# EAGLE design OneSLiPoCharger (EAGLE 7.7.0)
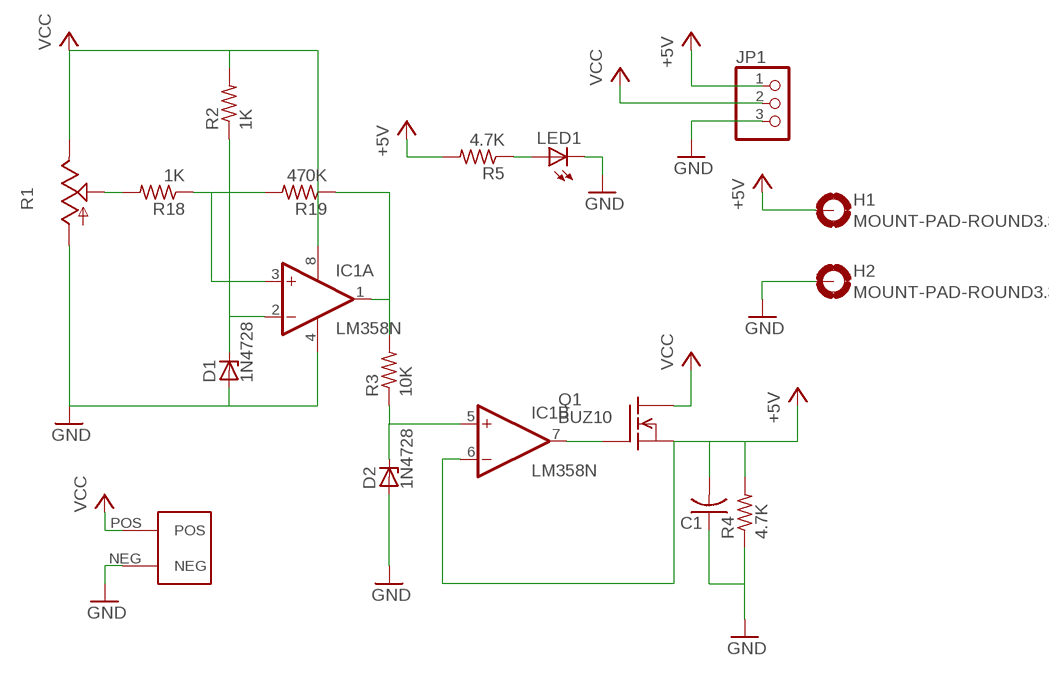
[diagram p0: schematic, sheet 1]

## Parts
C1  C-US025-025X050  [C025-025X050]
D1  1N4728  [DO41Z10]
D2  1N4728  [DO41Z10]
H1  MOUNT-PAD-ROUND3.3  [3,3-PAD]
H2  MOUNT-PAD-ROUND3.3  [3,3-PAD]
IC1  LM358N  [DIL08]
JP1  PINHD-1X3  [1X03]
LED1  LED3MM  [LED3MM]
Q1  BUZ10  [TO220]
R1  TRIM_US-B25P  [B25P]
R2  1K  R-US_0207/10  [0207/10]
R3  10K  R-US_0207/10  [0207/10]
R4  4.7K  R-US_0207/10  [0207/10]
R5  4.7K  R-US_0207/10  [0207/10]
R18  1K  R-US_0207/10  [0207/10]
R19  470K  R-US_0207/10  [0207/10]
U$3  XT60  [XT60]

## Nets
+5V: C1.2 H1.B3,3(MOUNT) IC1.6(B:-IN) JP1.1 Q1.3(S) R4.2 R5.2
GND: C1.1 D1.A D2.A H2.B3,3(MOUNT) IC1.4(P:V-) JP1.3 LED1.K(C) R1.A R4.1 U$3.NEG
N$1: R1.S R18.2
N$2: D2.C IC1.5(B:+IN) R3.1
N$3: D1.C IC1.2(A:-IN) R2.1
N$4: IC1.1(A:OUT) R3.2 R19.1
N$5: IC1.7(B:OUT) Q1.1(G)
N$10: LED1.A R5.1
N$31: IC1.3(A:+IN) R18.1 R19.2
VCC: IC1.8(P:V+) JP1.2 Q1.2(D) R1.E R2.2 U$3.POS

## Library data of the parts
C1 = rcl:C-US: CAPACITOR, American symbol
D1 D2 = diode:1N4728: Z DIODE 3.3 V, 1W, 5 percent
H1 H2 = holes:MOUNT-PAD-ROUND: MOUNTING PAD, round
IC1 = linear:LM358: OP AMP also LM158; LM258; LM2904 Source: http://cache.national.com/ds/LM/LM158.pdf
JP1 = pinhead:PINHD-1X3: PIN HEADER
LED1 = led:LED: LED OSRAM: - CHIPLED LG R971, LG N971, LY N971, LG Q971, LY Q971, LO R971, LY R971 LH N974, LH R974 LS Q976, LO Q976, LY Q976 LO Q996 - Hyper CHIPLED LW Q18S LB Q993, LB Q99A, LB R99A - SideLED LS A670, LO A670, LY A670, LG A670, LP A670 LB A673, LV A673, LT A673, LW A673 LH A674 LY A675 LS A676, LA A676, LO A676, LY A676, LW A676 LS A679, LY A679, LG A679 - Hyper Micro SIDELED® LS Y876, LA Y876, LO Y876, LY Y876 LT Y87S - SmartLED LW L88C, LW L88S LB L89C, LB L89S, LG L890 LS L89K, LO L89K, LY L89K LS L896, LA L896, LO L896, LY L896 - TOPLED LS T670, LO T670, LY T670, LG T670, LP T670 LSG T670, LSP T670, LSY T670, LOP T670, LYG T670 LG T671, LOG T671, LSG T671 LB T673, LV T673, LT T673, LW T673 LH T674 LS T676, LA T676, LO T676, LY T676, LB T676, LH T676, LSB T676, LW T676 LB T67C, LV T67C, LT T67C, LS T67K, LO T67K, LY T67K, LW E67C LS E67B, LA E67B, LO E67B, LY E67B, LB E67C, LV E67C, LT E67C LW T67C LS T679, LY T679, LG T679 LS T770, LO T770, LY T770, LG T770, LP T770 LB T773, LV T773, LT T773, LW T773 LH T774 LS E675, LA E675, LY E675, LS T675 LS T776, LA T776, LO T776, LY T776, LB T776 LHGB T686 LT T68C, LB T68C - Hyper Mini TOPLED® LB M676 - Mini TOPLED Santana® LG M470 LS M47K, LO M47K, LY M47K Source: http://www.osram.convergy.de LUXEON: - LUMILED® LXK2-PW12-R00, LXK2-PW12-S00, LXK2-PW14-U00, LXK2-PW14-V00 LXK2-PM12-R00, LXK2-PM12-S00, LXK2-PM14-U00 LXK2-PE12-Q00, LXK2-PE12-R00, LXK2-PE12-S00, LXK2-PE14-T00, LXK2-PE14-U00 LXK2-PB12-K00, LXK2-PB12-L00, LXK2-PB12-M00, LXK2-PB14-N00, LXK2-PB14-P00, LXK2-PB14-Q00 LXK2-PR12-L00, LXK2-PR12-M00, LXK2-PR14-Q00, LXK2-PR14-R00 LXK2-PD12-Q00, LXK2-PD12-R00, LXK2-PD12-S00 LXK2-PH12-R00, LXK2-PH12-S00 LXK2-PL12-P00, LXK2-PL12-Q00, LXK2-PL12-R00 Source: www.luxeon.com KINGBRIGHT: KA-3528ASYC Source: www.kingbright.com
Q1 = transistor-fet:BUZ10: N-Channel Enhancement MOSFET 50V; 20A; 0,080Ohm
R1 = pot:TRIM_US-: POTENTIOMETER
R2-R5 R18 R19 = rcl:R-US_: RESISTOR, American symbol
U$3 = XTConnector:XT60

## Board
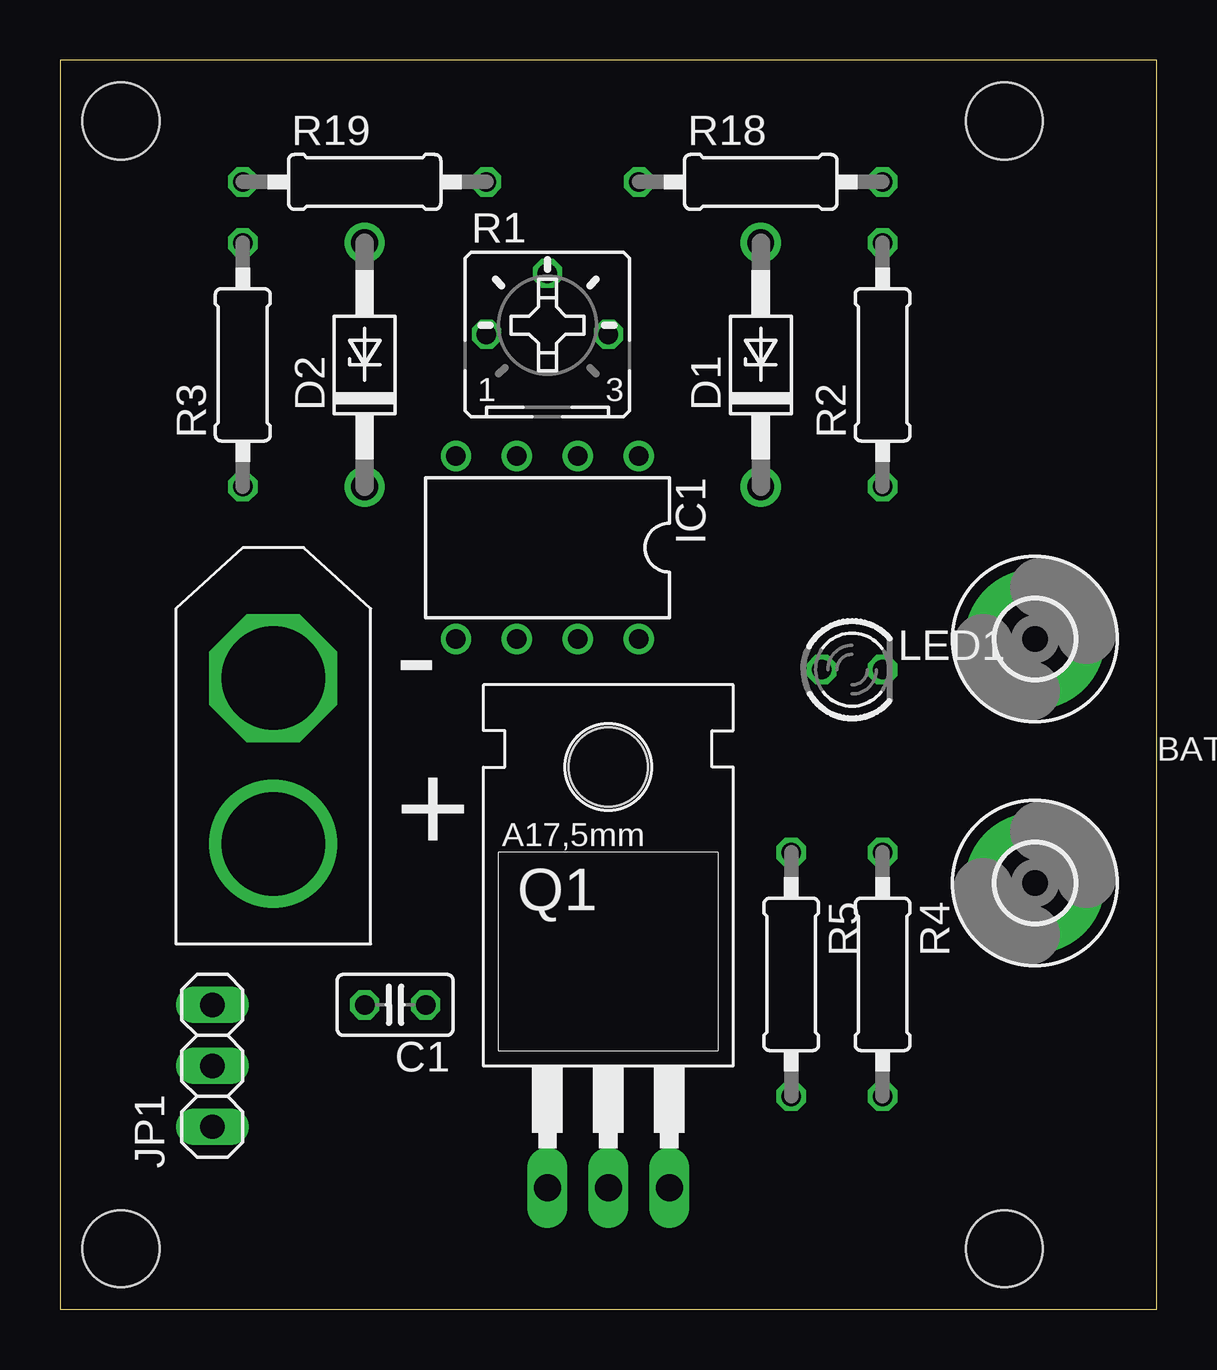
[diagram p1: board, top side]
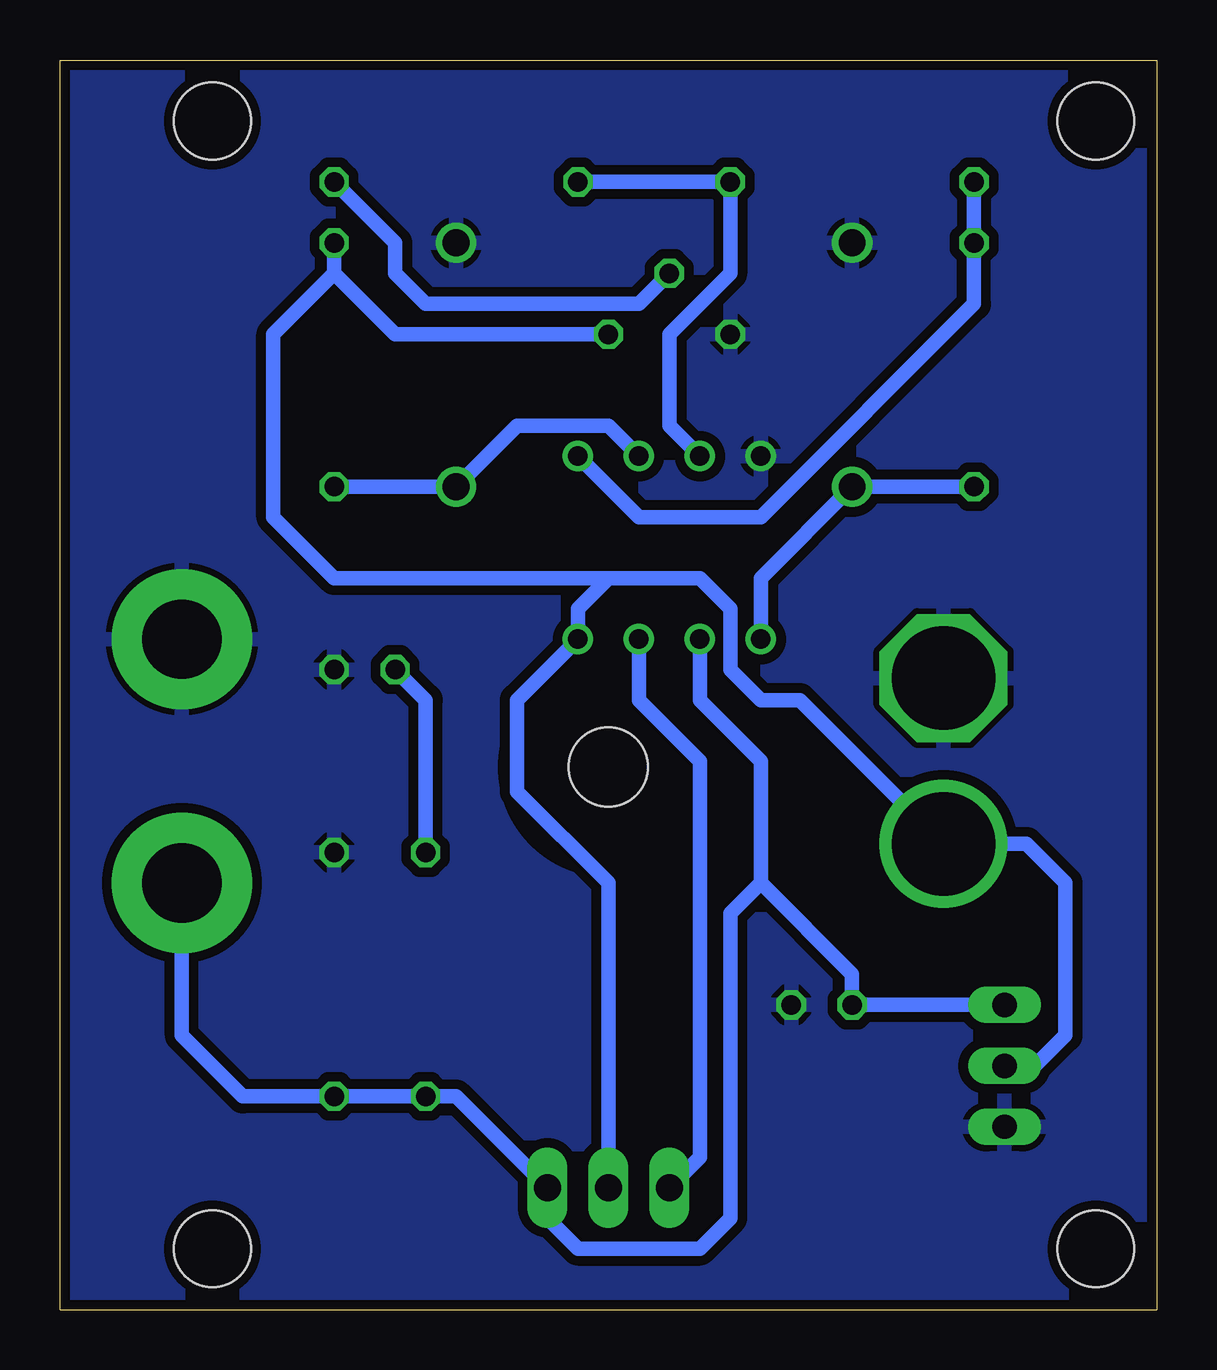
[diagram p2: board, bottom side, seen from below]

Size 45.72 x 52.07 mm. Coordinates in mm from the lower left corner, seen from the top.
Outline: 45.72,0 45.72,52.07 0,52.07 0,0 45.72,0
Copper layers (1*16): Top 0.0356mm / dielectric 1.5011mm / Bottom 0.0356mm
Design rules "LaenPCBOrder": minimum track width 6mil, minimum drill 13mil, track to track 6mil, track to pad 6mil, pad to pad 6mil, via to via 6mil, smd to smd 6mil, copper to edge 15mil, drill to drill 6mil, minimum pad ring 7mil, minimum via ring 7mil, stop-mask expansion 3mil, vias tented up to drill 0mil, thermal gap 10mil
Holes 3.2 mm at 2.54,2.54 2.54,49.53 39.37,49.53 39.37,2.54

### Footprints (pad centres in the part's own frame; a part is rotated, then mirrored left to right if it is on the bottom)
C025-025X050 = drill 0.813 octagon: 1 -1.27,0; 2 1.27,0
DO41Z10 = drill 1.118: A 5.08,0; C -5.08,0
3,3-PAD = drill 3.3 pad 5.842: B3,3 0,0
DIL08 = drill 0.813 pad 1.27: 1 -3.81,-3.81; 2 -1.27,-3.81; 3 1.27,-3.81; 4 3.81,-3.81; 5 3.81,3.81; 6 1.27,3.81; 7 -1.27,3.81; 8 -3.81,3.81
1X03 = drill 1.016 long: 1 -2.54,0; 2 0,0; 3 2.54,0
LED3MM = drill 0.813 octagon: A -1.27,0; K 1.27,0
TO220 = drill 1.118 long: 1 -2.54,-6.35; 2 0,-6.35; 3 2.54,-6.35 | hole 3.302: 0,11.176
B25P = drill 0.813 octagon: A -2.54,0; E 2.54,0; S 0,2.54
0207/10 = drill 0.813 octagon: 1 -5.08,0; 2 5.08,0
XT60 = drill 4.318 octagon: NEG 0,3.454 | drill 4.318: POS 0,-3.454

### Placement (x,y rotation side)
C1  13.97,12.7 180 top
D1  29.21,39.37 90 top
D2  12.7,39.37 90 top
DRILEGEND  [DRILEGEND]  -17.78,-9.8 0 top  (outside the outline)
H1  40.64,17.78 0 top
H2  40.64,27.94 0 top
IC1  20.32,31.75 180 top
JP1  6.35,10.16 270 top
LED1  33.02,26.67 0 top
Q1  22.86,11.43 0 top
R1  20.32,40.64 0 top
R2  34.29,39.37 90 top
R3  7.62,39.37 90 top
R4  34.29,13.97 270 top
R5  30.48,13.97 270 top
R18  29.21,46.99 0 top
R19  12.7,46.99 0 top
U$3  8.89,22.86 0 top

### Tracks (layer width: path | path; a pad name or v marks a point on that pad's centre or on a via)
+5V
  Bottom 0.61: IC1.6 19.05,25.4 16.51,22.86 16.51,17.78 | JP1.1 C1.2 12.7,13.97 16.51,17.78 | 16.51,17.78 17.78,16.51 17.78,3.81 19.05,2.54 24.13,2.54 25.4,3.81 Q1.3 29.21,8.89 R5.2 R4.2 38.1,8.89 40.64,11.43 H1.B3,3
GND
  pour Bottom (isolate 0.406): 0,0 45.72,0 45.72,52.07 0,52.07
N$1
  Bottom 0.61: R18.2 31.75,44.45 31.75,43.18 30.48,41.91 21.59,41.91 R1.S
N$2
  Bottom 0.61: R3.1 D2.C 16.51,30.48 IC1.5
N$3
  Bottom 0.61: IC1.2 22.86,36.83 26.67,36.83 D1.C R2.1
N$4
  Bottom 0.61: IC1.1 21.59,33.02 16.51,33.02 7.62,41.91 R3.2 R19.1
N$5
  Bottom 0.61: IC1.7 21.59,25.4 19.05,22.86 19.05,6.35 Q1.1
N$10
  Bottom 0.61: R5.1 30.48,25.4 LED1.A
N$31
  Bottom 0.61: R18.1 R19.2 17.78,43.18 20.32,40.64 20.32,36.83 IC1.3
VCC
  Bottom 0.61: R2.2 34.29,43.18 | 22.86,30.48 19.05,30.48 17.78,29.21 17.78,26.67 16.51,25.4 14.88,25.4 U$3.POS 5.44,19.41 3.81,17.78 3.81,11.43 5.08,10.16 JP1.2 | 22.86,30.48 24.13,29.21 IC1.8 26.67,25.4 26.67,21.59 22.86,17.78 Q1.2 | 22.86,30.48 34.29,30.48 36.83,33.02 36.83,40.64 34.29,43.18 | R1.E 31.75,40.64 34.29,43.18

### Text on the board
tNames: BAT4